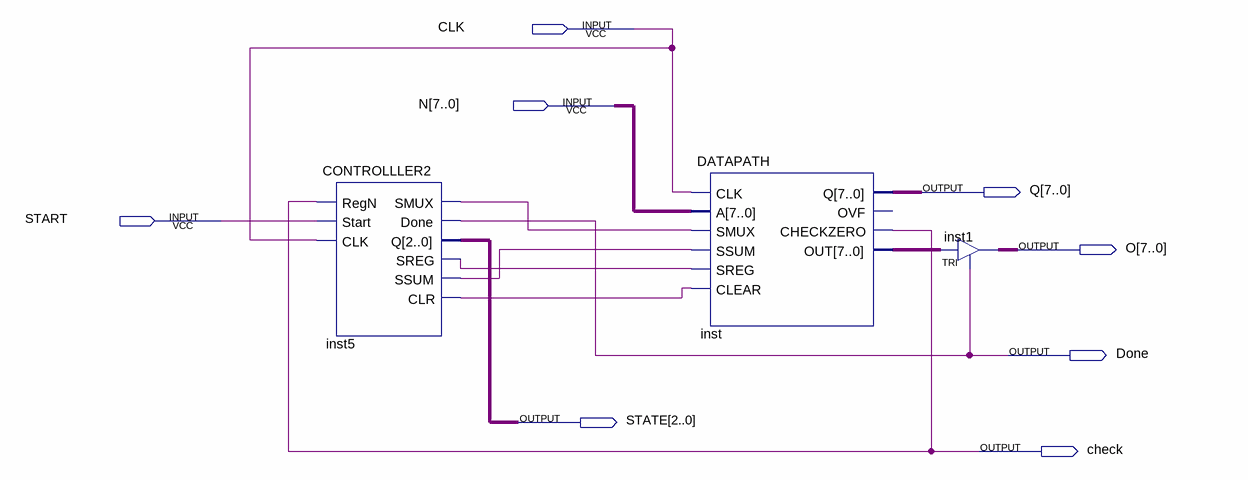
[diagram p0: schematic sheet]
// Quartus schematic Block3.bdf as structural Verilog: 3 symbols, 8 pins
module Block3 (
  input  CLK,
  input  [7:0] N,
  input  START,
  output [7:0] Q,
  output [7:0] O,
  output Done,
  output [2:0] STATE,
  output check
);

  wire inst5_clr, inst5_smux, inst5_sreg, inst5_ssum;
  wire [7:0] inst_out;

  CONTROLLLER2 inst5 (
    .RegN(check), .Start(START), .CLK(CLK), .SMUX(inst5_smux), .Done(Done), .Q(STATE), .SREG(inst5_sreg),
    .SSUM(inst5_ssum), .CLR(inst5_clr));
  DATAPATH inst (
    .CLK(CLK), .A(N), .SMUX(inst5_smux), .SSUM(inst5_ssum), .SREG(inst5_sreg), .CLEAR(inst5_clr), .Q(Q),
    .CHECKZERO(check), .OUT(inst_out));  // open: OVF
  TRI inst1[7:0] (.IN(inst_out), .OE(Done), .OUT(O));
endmodule
